# Altium project Rectifier.PrjPcb
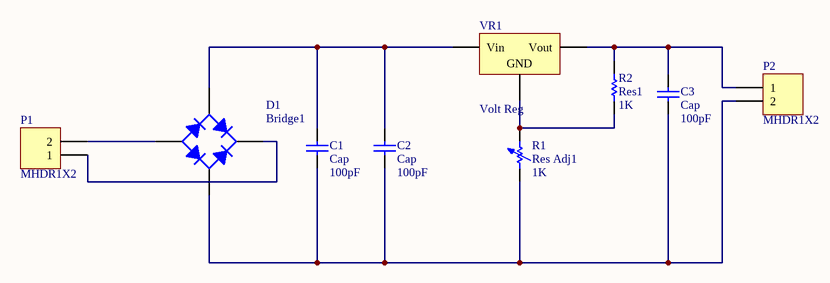
[diagram p0: rect.SchDoc]
1 sheet, 9 parts. Net scope: global (net labels, ports and power ports of the same name join across sheets).
Board file: rectnew.PcbDoc

## Sheet rect.SchDoc
size A

### Parts
C1  Cap  value 100pF  [RAD-0.3]
C2  Cap  value 100pF  [RAD-0.3]
C3  Cap  value 100pF  [RAD-0.3]
D1  Bridge1  [D-38]
P1  MHDR1X2  [MHDR1X2]
P2  MHDR1X2  [MHDR1X2]
R1  Res Adj1  value 1K  [AXIAL-0.7]
R2  Res1  value 1K  [AXIAL-0.3]
VR1  Volt Reg  [D2PAK_N]

### Nets
NetC1_1: C1.1 C2.1 C3.1 D1.2(C) P2.2 R1.1
NetC1_2: C1.2 C2.2 D1.4(C) VR1.1(Vin)
NetC3_2: C3.2 P2.1 R2.2 VR1.3(Vout)
NetD1_1: D1.1(K) P1.1
NetD1_3: D1.3(A) P1.2
NetR1_2: R1.2 R2.1 VR1.2(GND)

### Library data of the parts
C1-C3 = Cap: Capacitor; Published: 8-Jun-2000; LatestRevisionDate: 17-Jul-2002; LatestRevisionNote: Re-released for DXP Platform.; PackageReference: RAD-0.3; Publisher: Altium Limited; PackageDescription: Radial Cap, Thru-Hole; 2 Leads; 0.3 in Pin Spacing
D1 = Bridge1: Full Wave Diode Bridge; Published: 8-Jun-2000; LatestRevisionDate: 29-May-2009; LatestRevisionNote: Sch pins A & K swapped.; DatasheetVersion: E2732B; PackageReference: D-38; Publisher: Altium Limited; PackageDescription: Bridge Rectifier; 4 Terminals; Body 9.4 x 9.4 mm (typ); Pitch 5.08 mm
P1 P2 = MHDR1X2: Header, 2-Pin; LatestRevisionDate: 17-Jul-2002; LatestRevisionNote: Re-released for DXP Platform.; Publisher: Altium Limited
R1 = Res Adj1: Variable Resistor; Set Position: 0.5; Published: 8-Jun-2000; LatestRevisionDate: 17-Jul-2002; LatestRevisionNote: Re-released for DXP Platform.; PackageReference: AXIAL-0.7; Publisher: Altium Limited; PackageDescription: Axial Device, Thru-Hole; 2 Leads; 0.7 in Pin Spacing
R2 = Res1: Resistor; Published: 8-Jun-2000; LatestRevisionDate: 17-Jul-2002; LatestRevisionNote: Re-released for DXP Platform.; PackageReference: AXIAL-0.3; Publisher: Altium Limited; PackageDescription: Axial Device, Thru-Hole; 2 Leads; 0.3 in Pin Spacing
VR1 = Volt Reg: Voltage Regulator; Published: 24-Mar-1999; LatestRevisionDate: 29-May-2009; LatestRevisionNote: IPC-7351 Footprint Added.; PackageReference: D2PAK; Publisher: Altium Limited; PackageDescription: 3-Pin Transistor Outline Package 2.54 mm Pitch, 15.1 mm Lead Span